# Altium schematic sheet MKRWANV1.0_0.SchDoc: MKRWANV1.0
size 409 x 291 mm; Origin: Eagle; Date: 4/10/2019 9:46:02 AM; SheetNumber: 1; CODE-ARDUINO: DNP; DATASHEET: DNP; DISTRIBUTOR-LINK: DNP; DISTRIBUTOR-PN: DNP; MANUFACTURER: DNP; MANUFACTURER-PN: DNP; NOTE: DNP; Value: DNP; GateName_1: G$1; SymbolName_1: A3L-LOC; LibraryName: Arduino-utility; DeviceSetName: A3-FRAME; Sheet: Sheet:; ReferenceDesignsAREPROVIDED"ASIS"AND"WITHALLFAULTS.ArduinoSADISCLAIMSALLOTHERWARRANTIES,EXPRESSORIMPLIED,
REGARDINGPRODUCTS,INCLUDINGBUTNOTLIMITEDTO,ANYIMPLIEDWARRANTIESOFMERCHANTABILITYORFITNESSFORAPARTICULARPURPOSE

ArduinoSAmaymakechangestospecificationsandproductdescriptionsatanytime,withoutnotice.TheCustomermustnot
relyontheabsenceorcharacteristicsofanyfeaturesorinstructionsmarked"reserved"or"undefined."ArduinoSAreserves
theseforfuturedefinitionandshallhavenoresponsibilitywhatsoeverforconflictsorincompatibilitiesarisingfromfuturechangestothem.
TheproductinformationontheWebSiteorMaterialsissubjecttochangewithoutnotice.Donotfinalizeadesignwiththisinfo

ARDUINOandotherArduinobrandsandlogosandTrademarksofArduinoSA.AllArduinoSATrademarkscannotbeusedwithoutowner'sformalpermission: Reference Designs ARE PROVIDED "AS IS" AND "WITH ALL FAULTS. Arduino SA DISCLAIMS ALL OTHER WARRANTIES, EXPRESS OR IMPLIED, / REGARDING PRODUCTS, INCLUDING BUT NOT LIMITED TO, ANY IMPLIED WARRANTIES OF MERCHANTABILITY OR FITNESS FOR A PARTICULAR PURPOSE / Arduino SA may make changes to specifications and product descriptions at any time, without notice. The Customer must not / rely on the absence or characteristics of any features or instructions marked "reserved" or "undefined." Arduino SA reserves / these for future definition and shall have no responsibility whatsoever for conflicts or incompatibilities arising from future changes to them. / The product information on the Web Site or Materials is subject to change without notice. Do not finalize a design with this info / ARDUINO and other Arduino brands and logos and Trademarks of Arduino SA. All Arduino SA Trademarks cannot be used without owner's formal permission
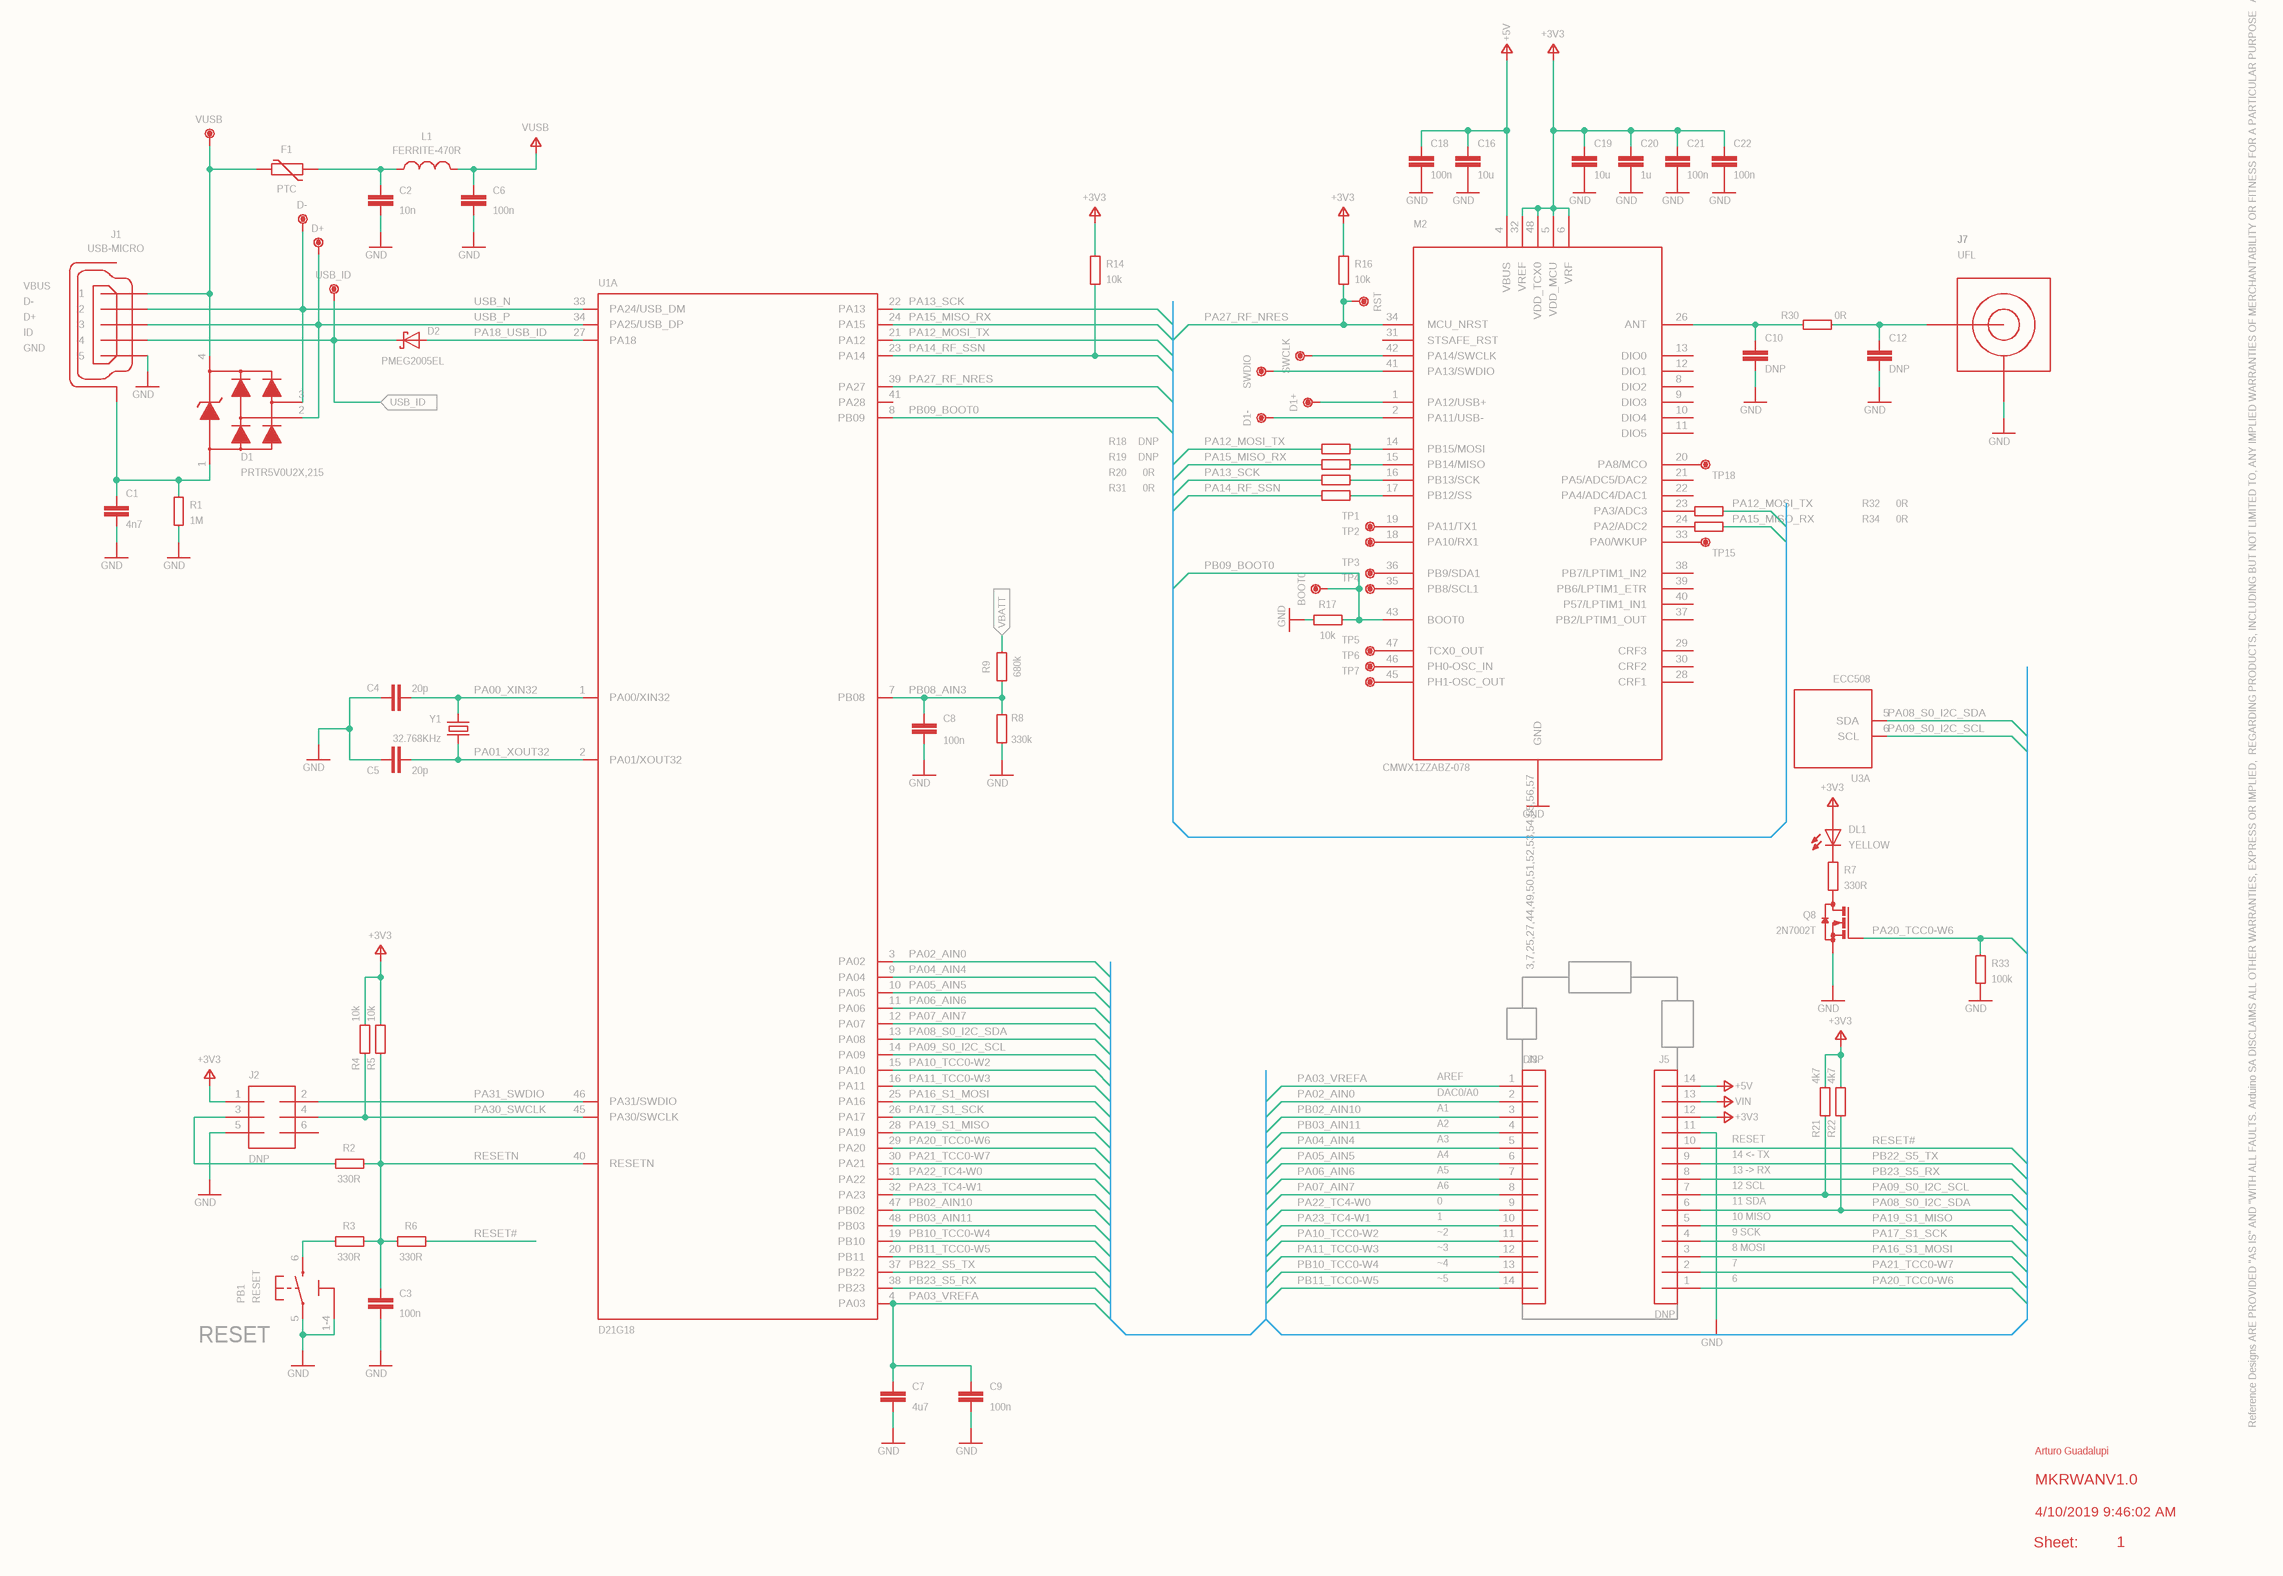
[diagram p0: MKRWANV1.0_0.SchDoc]

## Parts
+3V2  +3V3
+3V4  +3V3
+3V5  +3V3
+3V6  +3V3
+3V31  +3V3
+3V32  +3V3
+3V34  +3V3
+3V36  +3V3
BOOT0  DNP  [TP-1.00MM]  (value not drawn)
C1  4n7  [0805-R2013X50N]
C2  10n  [0402-1005X55N]
C3  100n  [0402-1005X55N]
C4  20p  [0402-1005X55N]
C5  20p  [0402-1005X55N]
C6  100n  [0402-1005X55N]
C7  4u7  [0402-1005X55N]
C8  100n  [0402-1005X55N]
C9  100n  [0402-1005X55N]
C10  DNP  [0402-1005X55N]
C12  DNP  [0402-1005X55N]
C16  10u  [0603-1608X90N]
C18  100n  [0402-1005X55N]
C19  10u  [0603-1608X90N]
C20  1u  [0402-1005X55N]
C21  100n  [0402-1005X55N]
C22  100n  [0402-1005X55N]
D1  PRTR5V0U2X,215  [SOT190P230X110-4N]
D1+  DNP  [TP-1.00MM]  (value not drawn)
D1-  DNP  [TP-1.00MM]  (value not drawn)
D2  PMEG2005EL  [SODFL1008X40N-882D]
D+  DNP  [TP-1.00MM]  (value not drawn)
D-  DNP  [TP-1.00MM]  (value not drawn)
DL1  YELLOW  [LEDC1608X80N-AK]
F1  PTC  [0603-1608X90N]
GND1  GND
GND2  GND
GND3  GND
GND4  GND
GND5  GND
GND6  GND
GND7  GND
GND8  GND
GND9  GND
GND10  GND
GND11  GND
GND12  GND
GND13  GND
GND15  GND
GND17  GND
GND19  GND
GND21  GND
GND22  GND
GND23  GND
GND24  GND
GND33  GND
GND34  GND
GND35  GND
GND36  GND
GND37  GND
GND38  GND
GND39  GND
J1  USB-MICRO  [ZX62-AB-5PA]
J2  DNP  [2X3_SMT]
J3  DNP  [1X14_SMD_TH]
J5  DNP  [1X14_SMD_TH]
J7  UFL  [U.FL-R-SMT-1(60)]
L1  FERRITE-470R  [0603-1608X90N@1]
M2  CMWX1ZZABZ-078  [CMWX1ZZABZ-078]
P+1  +5V
P+2  +5V
PB1  RESET  [C&K_PTS820_NO_HOLES]
Q8  2N7002T  [SOTFL50P160X78-3]
R1  1M  [0402-1005X55N]
R2  330R  [0402-1005X55N]
R3  330R  [0402-1005X55N]
R4  10k  [0402-1005X55N]
R5  10k  [0402-1005X55N]
R6  330R  [0402-1005X55N]
R7  330R  [0402-1005X55N]
R8  330k  [0402-1005X55N]
R9  680k  [0402-1005X55N]
R14  10k  [0402-1005X55N]
R16  10k  [0402-1005X55N]
R17  10k  [0402-1005X55N]
R18  DNP  [0402-1005X55N]
R19  DNP  [0402-1005X55N]
R20  0R  [0402-1005X55N]
R21  4k7  [0402-1005X55N]
R22  4k7  [0402-1005X55N]
R30  0R  [0402-1005X55N]
R31  0R  [0402-1005X55N]
R32  0R  [0402-1005X55N]
R33  100k  [0402-1005X55N]
R34  0R  [0402-1005X55N]
RST  DNP  [TP-1.00MM]  (value not drawn)
SWCLK  DNP  [TP-1.00MM]  (value not drawn)
SWDIO  DNP  [TP-1.00MM]  (value not drawn)
TP1  DNP  [TP-0.50MM]  (value not drawn)
TP2  DNP  [TP-0.50MM]  (value not drawn)
TP3  DNP  [TP-0.50MM]  (value not drawn)
TP4  DNP  [TP-0.50MM]  (value not drawn)
TP5  DNP  [TP-0.50MM]  (value not drawn)
TP6  DNP  [TP-0.50MM]  (value not drawn)
TP7  DNP  [TP-0.50MM]  (value not drawn)
TP15  DNP  [TP-0.50MM]  (value not drawn)
TP18  DNP  [TP-0.50MM]  (value not drawn)
U1  D21G18  [QFN50P700X700X90-49XN-EPSQ515]  (part A of 2)
U3  ECC508  [SON50P300X200X60-9N-EP160X140]  (part A of 2)
USB_ID  DNP  [TP-1.00MM]  (value not drawn)
V1  VUSB
VIN1  VIN
VUSB  DNP  [TP-1.00MM]  (value not drawn)
Y1  32.768KHz  [ABS07]

## Ports
USB_ID (in), VBATT (in)

## Nets
PA00_XIN32: C4.2 U1.1(PA00/XIN32) Y1.2
PA01_XOUT32: C5.2 U1.2(PA01/XOUT32) Y1.1
PA02_AIN0: J3.2 U1.3(PA02)
PA03_VREFA: C7.1 C9.1 J3.1 U1.4(PA03)
PA04_AIN4: J3.5 U1.9(PA04)
PA05_AIN5: J3.6 U1.10(PA05)
PA06_AIN6: J3.7 U1.11(PA06)
PA07_AIN7: J3.8 U1.12(PA07)
PA08_S0_I2C_SDA: J5.6 R22.1 U1.13(PA08) U3.5(SDA)
PA09_S0_I2C_SCL: J5.7 R21.1 U1.14(PA09) U3.6(SCL)
PA10_TCC0-W2: J3.11 U1.15(PA10)
PA11_TCC0-W3: J3.12 U1.16(PA11)
PA12_MOSI_TX: R18.2 R32.2 U1.21(PA12)
PA13_SCK: R20.2 U1.22(PA13)
PA14_RF_SSN: R14.1 R31.2 U1.23(PA14)
PA15_MISO_RX: M2.34(MCU_NRST) R16.1 R19.2 R34.2 RST.X(P$1) U1.24(PA15) U1.39(PA27)  [also labelled PA27_RF_NRES]
PA16_S1_MOSI: J5.3 U1.25(PA16)
PA17_S1_SCK: J5.4 U1.26(PA17)
PA18_USB_ID: D2.A U1.27(PA18)
PA19_S1_MISO: J5.5 U1.28(PA19)
PA20_TCC0-W6: J5.1 Q8.G R33.2 U1.29(PA20)
PA21_TCC0-W7: J5.2 U1.30(PA21)
PA22_TC4-W0: J3.9 U1.31(PA22)
PA23_TC4-W1: J3.10 U1.32(PA23)
PA30_SWCLK: J2.4 R4.1 U1.45(PA30/SWCLK)
PA31_SWDIO: J2.2 U1.46(PA31/SWDIO)
PB02_AIN10: J3.3 U1.47(PB02)
PB03_AIN11: J3.4 U1.48(PB03)
PB08_AIN3: C8.1 R8.2 R9.1 U1.7(PB08)
PB09_BOOT0: BOOT0.X(P$1) M2.43(BOOT0) R17.2 U1.8(PB09)
PB10_TCC0-W4: J3.13 U1.19(PB10)
PB11_TCC0-W5: J3.14 U1.20(PB11)
PB22_S5_TX: J5.9 U1.37(PB22)
PB23_S5_RX: J5.8 U1.38(PB23)
RESET#: J5.10 R6.2
RESETN: C3.1 R2.2 R3.2 R5.1 R6.1 U1.40(RESETN)
USB_ID: D2.C J1.4 USB_ID.X(P$1) ; port USB_ID
USB_N: D1.3 D-.X(P$1) J1.2 U1.33(PA24/USB_DM)
USB_P: D1.2 D+.X(P$1) J1.3 U1.34(PA25/USB_DP)
VBATT: R9.2 ; port VBATT
Net+3V2_?1: +3V2.?1(+3V3) DL1.A
Net+3V4_?1: +3V4.?1(+3V3) C19.1 C20.1 C21.1 C22.1 M2.5(VDD_MCU) M2.6(VRF) M2.32(VREF) M2.48(VDD_TCX0)
Net+3V5_?1: +3V5.?1(+3V3) R14.2
Net+3V6_?1: +3V6.?1(+3V3) R16.2
Net+3V31_?1: +3V31.?1(+3V3) J2.1
Net+3V32_?1: +3V32.?1(+3V3) R4.2 R5.2
Net+3V34_?1: +3V34.?1(+3V3) J5.12
Net+3V36_?1: +3V36.?1(+3V3) R21.2 R22.2
NetC1_1: C1.1 D1.1 J1.6-11(SH) R1.2
NetC1_2: C1.2 GND1.?1(GND)
NetC2_1: C2.1 F1.1 L1.1
NetC2_2: C2.2 GND7.?1(GND)
NetC3_2: C3.2 GND8.?1(GND)
NetC4_1: C4.1 C5.1 GND6.?1(GND)
NetC6_1: C6.1 L1.2 V1.?1(VUSB)
NetC6_2: C6.2 GND9.?1(GND)
NetC7_2: C7.2 GND10.?1(GND)
NetC8_2: C8.2 GND11.?1(GND)
NetC9_2: C9.2 GND12.?1(GND)
NetC10_1: C10.1 M2.26(ANT) R30.1
NetC10_2: C10.2 GND24.?1(GND)
NetC12_1: C12.1 J7.SIG R30.2
NetC12_2: C12.2 GND23.?1(GND)
NetC16_1: C16.1 C18.1 M2.4(VBUS) P+1.?1(+5V)
NetC16_2: C16.2 GND35.?1(GND)
NetC18_2: C18.2 GND36.?1(GND)
NetC19_2: C19.2 GND37.?1(GND)
NetC20_2: C20.2 GND38.?1(GND)
NetC21_2: C21.2 GND39.?1(GND)
NetC22_2: C22.2 GND21.?1(GND)
NetD1+_X: D1+.X(P$1) M2.1(PA12/USB+)
NetD1-_X: D1-.X(P$1) M2.2(PA11/USB-)
NetD1_4: D1.4 F1.2 J1.1 VUSB.X(P$1)
NetDL1_C: DL1.C R7.2
NetGND2_?1: GND2.?1(GND) J1.5
NetGND3_?1: GND3.?1(GND) R1.1
NetGND4_?1: GND4.?1(GND) J2.5
NetGND5_?1: GND5.?1(GND) PB1.1-4 PB1.5
NetGND13_?1: GND13.?1(GND) R8.1
NetGND15_?1: GND15.?1(GND) Q8.S
NetGND17_?1: GND17.?1(GND) M2.3,7,25,27,44,49,50,51,52,53,54,55,56,57(GND)
NetGND19_?1: GND19.?1(GND) J5.11
NetGND22_?1: GND22.?1(GND) J7.GND1,2(GND)
NetGND33_?1: GND33.?1(GND) R33.1
NetGND34_?1: GND34.?1(GND) R17.1
NetJ2_3: J2.3 R2.1
NetJ5_13: J5.13 VIN1.?1(VIN)
NetJ5_14: J5.14 P+2.?1(+5V)
NetM2_14: M2.14(PB15/MOSI) R18.1
NetM2_15: M2.15(PB14/MISO) R19.1
NetM2_16: M2.16(PB13/SCK) R20.1
NetM2_17: M2.17(PB12/SS) R31.1
NetM2_18: M2.18(PA10/RX1) TP2.X(P$1)
NetM2_19: M2.19(PA11/TX1) TP1.X(P$1)
NetM2_20: M2.20(PA8/MCO) TP18.X(P$1)
NetM2_23: M2.23(PA3/ADC3) R32.1
NetM2_24: M2.24(PA2/ADC2) R34.1
NetM2_33: M2.33(PA0/WKUP) TP15.X(P$1)
NetM2_35: M2.35(PB8/SCL1) TP4.X(P$1)
NetM2_36: M2.36(PB9/SDA1) TP3.X(P$1)
NetM2_41: M2.41(PA13/SWDIO) SWDIO.X(P$1)
NetM2_42: M2.42(PA14/SWCLK) SWCLK.X(P$1)
NetM2_45: M2.45(PH1-OSC_OUT) TP7.X(P$1)
NetM2_46: M2.46(PH0-OSC_IN) TP6.X(P$1)
NetM2_47: M2.47(TCX0_OUT) TP5.X(P$1)
NetPB1_6: PB1.6 R3.1
NetQ8_D: Q8.D R7.1

Not connected (* = marked no-connect by the designer): J2 6; M2 8(DIO2) 9(DIO3) 10(DIO4) 11(DIO5) 12(DIO1) 13(DIO0) 21(PA5/ADC5/DAC2) 22(PA4/ADC4/DAC1) 28(CRF1) 29(CRF3) 30(CRF2) 31(STSAFE_RST) 37(PB2/LPTIM1_OUT) 38(PB7/LPTIM1_IN2) 39(PB6/LPTIM1_ETR) 40(P57/LPTIM1_IN1); U1 41(PA28)

## Notes on the sheet
- AREF
- (near J3) DAC0/A0
- A1
- A2
- A3
- A4
- A5
- A6
- 14 <- TX
- 13 -> RX
- 12 SCL
- (near +3V34) RESET
- 0
- 1
- ~2
- ~3
- ~4
- 11 SDA
- 7
- 8 MOSI
- 9 SCK
- 10 MISO
- RESET
- ~5
- 6
- Reference Designs ARE PROVIDED "AS IS" AND "WITH ALL FAULTS. Arduino SA DISCLAIMS ALL OTHER WARRANTIES, EXPRESS OR IMPLIED,
  REGARDING PRODUCTS, INCLUDING BUT NOT LIMITED TO, ANY IMPLIED WARRANTIES OF MERCHANTABILITY OR FITNESS FOR A PARTICULAR PURPOSE
  Arduino SA may make changes to specifications and product descriptions at any time, without notice. The Customer must not
  rely on the absence or characteristics of any features or instructions marked "reserved" or "undefined." Arduino SA reserves
  these for future definition and shall have no responsibility whatsoever for conflicts or incompatibilities arising from future changes to them.
  The product information on the Web Site or Materials is subject to change without notice. Do not finalize a design with this info
  ARDUINO and other Arduino brands and logos and Trademarks of Arduino SA. All Arduino SA Trademarks cannot be used without owner's formal permission
- Arturo Guadalupi
- MKRWANV1.0
- Sheet:
- 4/10/2019 9:46:02 AM

## Library data of the parts
+3V2 +3V4-+3V6 +3V31 +3V32 +3V34 +3V36 = +3V3: SUPPLY SYMBOL; GateName_1: G$1; SymbolName_1: +3V3; LibraryName: MK1_Zero; DeviceSetName: +3V3
BOOT0 D1+ D1- D+ D- RST SWCLK SWDIO USB_ID VUSB = TPTP-1.00MM: Testpoint; GateName_1: G$1; DeviceSetName: TP; SymbolName_1: TESTPOINT; DeviceName: TP-1.00MM; LibraryName: Arduino-utility; DATASHEET: DNP; DISTRIBUTOR-LINK: DNP; DISTRIBUTOR-PN: DNP; MANUFACTURER: DNP; MANUFACTURER-PN: DNP
C1 = C-0805: SMD Capacitor; MANUFACTURER: Kemet; MANUFACTURER-PN: C0805C472KDRACTU; GateName_1: G$1; SymbolName_1: C; DeviceName: -0805; LibraryName: Arduino-rcl; DeviceSetName: C; DATASHEET: http://www.kemet.com/Lists/ProductCatalog/Attachments/40/KEM_C1010_X7R_HV_SMD.pdf; DISTRIBUTOR-LINK: www.kemet.com/docfinder?Partnumber=C0805C472KDRACTU; DISTRIBUTOR-PN: 399-6738-1-ND
C2 = C-0402: SMD Capacitor; MANUFACTURER: Murata; MANUFACTURER-PN: GRM155R71H103KA88J; GateName_1: G$1; SymbolName_1: C; DeviceName: -0402; LibraryName: Arduino-rcl; DeviceSetName: C; DATASHEET: http://search.murata.co.jp/Ceramy/image/img/A01X/partnumbering_e_01.pdf; DISTRIBUTOR-LINK: http://www.digikey.com/product-detail/en/murata-electronics-north-america/GRM155R71H103KA88J/490-6351-1-ND/3845548; DISTRIBUTOR-PN: 490-6351-1-ND
C3 C6 C8 C9 C18 C21 C22 = C-0402: SMD Capacitor; MANUFACTURER: TDK; MANUFACTURER-PN: C1005X5R1H104K050BB; GateName_1: G$1; SymbolName_1: C; DeviceName: -0402; LibraryName: Arduino-rcl; DeviceSetName: C; DATASHEET: http://www.tdk.com/pdf/TDKMLCCCapRange.pdf; DISTRIBUTOR-LINK: http://www.digikey.com/product-detail/en/tdk-corporation/C1005X5R1H104K050BB/445-5942-1-ND/2443982; DISTRIBUTOR-PN: 445-5942-1-ND
C4 C5 = C-0402: SMD Capacitor; MANUFACTURER: Kemet; MANUFACTURER-PN: CBR04C200J5GAC; GateName_1: G$1; SymbolName_1: C; DeviceName: -0402; LibraryName: Arduino-rcl; DeviceSetName: C; DATASHEET: http://www.kemet.com/docfinder?Partnumber=CBR04C200J5GAC; DISTRIBUTOR-LINK: http://www.digikey.com/product-detail/en/kemet/CBR04C200J5GAC/399-6173-1-ND/2732143; DISTRIBUTOR-PN: 399-6173-1-ND
C7 = C-0402: SMD Capacitor; MANUFACTURER: Murata; MANUFACTURER-PN: GRM155R60J475ME47D; GateName_1: G$1; SymbolName_1: C; DeviceName: -0402; LibraryName: Arduino-rcl; DeviceSetName: C; DATASHEET: http://search.murata.co.jp/Ceramy/image/img/A01X/partnumbering_e_01.pdf; DISTRIBUTOR-LINK: http://www.digikey.com/product-detail/en/murata-electronics-north-america/GRM155R60J475ME47D/490-5915-1-ND/3719860; DISTRIBUTOR-PN: 490-5915-1-ND
C10 C12 = C-0402: SMD Capacitor; GateName_1: G$1; SymbolName_1: C; DeviceName: -0402; LibraryName: Arduino-rcl; DeviceSetName: C; DATASHEET: DNP; DISTRIBUTOR-LINK: DNP; DISTRIBUTOR-PN: DNP; MANUFACTURER: DNP; MANUFACTURER-PN: DNP
C16 C19 = C-0603: SMD Capacitor; MANUFACTURER: Murata; MANUFACTURER-PN: GRM188R61C106KAALD; GateName_1: G$1; SymbolName_1: C; DeviceName: -0603; LibraryName: Arduino-rcl; DeviceSetName: C; DATASHEET: http://www.murata.com/~/media/webrenewal/support/library/catalog/products/capacitor/mlcc/c02e.pdf; DISTRIBUTOR-LINK: http://www.digikey.com/product-search/en?keywords=490-10728-1-ND; DISTRIBUTOR-PN: 490-10728-1-ND
C20 = C-0402: SMD Capacitor; MANUFACTURER: Murata; MANUFACTURER-PN: GRM155R61E105KA12D; GateName_1: G$1; SymbolName_1: C; DeviceName: -0402; LibraryName: Arduino-rcl; DeviceSetName: C; DATASHEET: http://search.murata.co.jp/Ceramy/image/img/A01X/partnumbering_e_01.pdf; DISTRIBUTOR-LINK: http://www.digikey.com/product-detail/en/murata-electronics-north-america/GRM155R61E105KA12D/490-10017-1-ND/5026367; DISTRIBUTOR-PN: 490-10017-1-ND
D1 = PRTR5V0U2X,215: USB ESD protection; MANUFACTURER: NXP; GateName_1: G$1; SymbolName_1: PRTR5V0U2X; LibraryName: Arduino-diodes; DeviceSetName: PRTR5V0U2X,215; DATASHEET: http://www.nxp.com/documents/data_sheet/PRTR5V0U2X.pdf; DISTRIBUTOR-LINK: http://www.digikey.com/product-detail/en/nxp-semiconductors/PRTR5V0U2X,215/568-4140-1-ND/1589981; DISTRIBUTOR-PN: 568-4140-1-ND; MANUFACTURER-PN: PRTR5V0U2X,215
D2 = PMEG2005EL: DIODE SCHOTTKY 20V 500MA SOD882; MANUFACTURER: NXP; MANUFACTURER-PN: PMEG2005EL,315; GateName_1: G$1; SymbolName_1: SCHOTTKY-1; LibraryName: Arduino-diodes; DeviceSetName: PMEG2005EL; DATASHEET: http://www.nxp.com/documents/data_sheet/PMEG2005EL.pdf; DISTRIBUTOR-LINK: http://www.digikey.com/product-detail/en/nxp-semiconductors/PMEG2005EL,315/568-6754-1-ND/2676794; DISTRIBUTOR-PN: 568-6754-1-ND
DL1 = LED-0603: LED; MANUFACTURER: Avago; MANUFACTURER-PN: HSMY-C190; GateName_1: G$1; DeviceName: -0603; SymbolName_1: LED; LibraryName: Arduino-diodes; DeviceSetName: LED; DATASHEET: http://media.digikey.com/pdf/Data%20Sheets/Avago%20PDFs/HSMz-Czzz.pdf; DISTRIBUTOR-LINK: http://www.digikey.com/product-detail/en/broadcom-limited/HSMY-C190/516-1424-1-ND/637748; DISTRIBUTOR-PN: 516-1424-1-ND
F1 = PTC: SMD PTC; MANUFACTURER: Bourns Inc; MANUFACTURER-PN: MF-FSMF050X-2; GateName_1: G$1; SymbolName_1: PTC; LibraryName: Arduino-rcl; DeviceSetName: PTC; DATASHEET: http://www.bourns.com/docs/Product-Datasheets/mffsmf.pdf; DISTRIBUTOR-LINK: http://www.digikey.com/product-detail/en/bourns-inc/MF-FSMF050X-2/MF-FSMF050X-2CT-ND/2039389; DISTRIBUTOR-PN: MF-FSMF050X-2CT-ND
GND1-GND13 GND15 GND17 GND19 GND21-GND24 GND33-GND39 = GND: SUPPLY SYMBOL; GateName_1: 1; SymbolName_1: GND; LibraryName: supply1; DeviceSetName: GND
J1 = USB-MICRO: USB - micro AB USB 2.0 Receptacle Connector 5 Position Surface Mount, Right Angle, Horizontal; MANUFACTURER: Hirose; MANUFACTURER-PN: ZX62-AB-5PA(31); GateName_1: G$1; SymbolName_1: USB-MICRO; LibraryName: Arduino-connectors; DeviceSetName: USB-MICRO; VBUS: VBUS; D-: D-; D+: D+; ID: ID; GND: GND; DATASHEET: https://www.hirose.com/product/en/download_file/key_name/ZX/category/Catalog/doc_file_id/31704/?file_category_id=4&item_id=13&is_series=1; DISTRIBUTOR-LINK: http://www.digikey.com/product-detail/en/hirose-electric-co-ltd/ZX62-AB-5PA(31)/H125279CT-ND/5994741; DISTRIBUTOR-PN: H125279CT-ND
J2 = 2X3_SMD_MALE: SMD connector; GateName_1: G$1; SymbolName_1: 3X02; LibraryName: Arduino-connectors; DeviceSetName: 2X3_SMD_MALE; DATASHEET: DNP; DISTRIBUTOR-LINK: DNP; DISTRIBUTOR-PN: DNP; MANUFACTURER: DNP; MANUFACTURER-PN: DNP
J3 J5 = PINHD-1X14-SMTH-SMD: PIN HEADER; MANUFACTURER: ELDECO; MANUFACTURER-PN: FH254114DF08500T; GateName_1: G$1; SymbolName_1: PINH-1X14-SM; DeviceName: TH-SMD; LibraryName: Arduino-connectors; DeviceSetName: PINHD-1X14-SM; DATASHEET: -; DISTRIBUTOR-LINK: -; DISTRIBUTOR-PN: -
J7 = UFL: U.FL, Ultra Miniature Coaxial Connector Receptacle, Male Pin 50 Ohm Surface Mount Solder; MANUFACTURER: Hirose; GateName_1: G$1; SymbolName_1: U.FL-R-SMT-1(60); LibraryName: Arduino-connectors; DeviceSetName: UFL; DATASHEET: http://media.digikey.com/pdf/Data%20Sheets/Hirose%20PDFs/UFL%20Series.pdf; DISTRIBUTOR-LINK: http://www.digikey.com/product-search/en?keywords=U.FL-R-SMT-1(60); DISTRIBUTOR-PN: U.FL-R-SMT-1(60)-ND; MANUFACTURER-PN: U.FL-R-SMT-1(60)
L1 = FERRITE-470R: FERRITE BEAD 470 OHM 0603 1LN; MANUFACTURER: Murata; MANUFACTURER-PN: BLM18PG471SN1D; GateName_1: G$1; SymbolName_1: L; LibraryName: Arduino-rcl; DeviceSetName: FERRITE-470R; DATASHEET: http://search.murata.co.jp/Ceramy/image/img/PDF/ENG/L0110S0100BLM18P.pdf; DISTRIBUTOR-LINK: http://www.digikey.com/product-detail/en/murata-electronics-north-america/BLM18PG471SN1D/490-5223-1-ND/1948399; DISTRIBUTOR-PN: 490-5223-1-ND
M2 = CMWX1ZZABZ-078: MANUFACTURER: Murata; GateName_1: G$1; SymbolName_1: CMWX1ZZABZ-078; LibraryName: Arduino-ucs&SoCs; DeviceSetName: CMWX1ZZABZ-078; CMWX1ZZABZ-078: CMWX1ZZABZ-078; DATASHEET: https://www.arrow.altech.co.za/sites/arrow/files/Murata%20LoRa%20Module%20Preliminary%20Datasheet%20SP-ABZ-G.PDF; DISTRIBUTOR-LINK: https://www.digikey.com/product-detail/en/murata-electronics-north-america/CMWX1ZZABZ-078/490-16143-1-ND/6834151; DISTRIBUTOR-PN: 490-16143-1-ND; MANUFACTURER-PN: CMWX1ZZABZ-078
P+1 P+2 = +5V: SUPPLY SYMBOL; GateName_1: 1; SymbolName_1: +5V; LibraryName: MK1_Zero; DeviceSetName: +5V
PB1 = TACTILE1: Tactile Switch SPST-NO Top Actuated Surface Mount; MANUFACTURER: C&K; MANUFACTURER-PN: PTS820 J25K SMTR LFS; GateName_1: G$1; SymbolName_1: TACTILE-3PINS; LibraryName: Arduino-pushbuttons; DeviceSetName: TACTILE1; DATASHEET: http://www.ckswitches.com/media/1474/pts820.pdf; DISTRIBUTOR-LINK: http://www.digikey.com/product-detail/en/c-k-components/PTS820%20J25K%20SMTR%20LFS/PTS820%20J25K%20SMTR%20LFS-ND/4142165; DISTRIBUTOR-PN: PTS820 J25K SMTR LFS-ND
Q8 = 2N7002T: MOSFET N-CH 60V 115MA SOT-523; MANUFACTURER: Diodes Incorporated; MANUFACTURER-PN: 2N7002T-7-F; GateName_1: G$1; SymbolName_1: N-MOS-1; LibraryName: Arduino-transistors; DeviceSetName: 2N7002T; DATASHEET: http://www.diodes.com/_files/datasheets/ds30301.pdf; DISTRIBUTOR-LINK: http://www.digikey.com/product-detail/en/diodes-incorporated/2N7002T-7-F/2N7002T-FDICT-ND/815290; DISTRIBUTOR-PN: 2N7002T-FDICT-ND
R1 = R-0402: SMD Resistor; MANUFACTURER: Yageo; MANUFACTURER-PN: RC0402JR-07330RL; GateName_1: G$1; SymbolName_1: R; DeviceName: -0402; LibraryName: Arduino-rcl; DeviceSetName: R; DATASHEET: www.yageo.com.tw/exep/pages/download/literatures/PYu-R_INT-thick_7.pdf; DISTRIBUTOR-LINK: http://www.digikey.com/product-detail/en/yageo/RC0402JR-07330RL/311-330JRCT-ND/729412; DISTRIBUTOR-PN: 311-330JRCT-ND
R2 R3 R6 R7 = R-0402: SMD Resistor; MANUFACTURER: Yageo; MANUFACTURER-PN: RC0402FR-07330RL; GateName_1: G$1; SymbolName_1: R; DeviceName: -0402; LibraryName: Arduino-rcl; DeviceSetName: R; DATASHEET: www.yageo.com.tw/exep/pages/download/literatures/PYu-R_INT-thick_7.pdf; DISTRIBUTOR-LINK: http://www.digikey.com/product-detail/en/yageo/RC0402FR-07330RL/311-330LRCT-ND/729541; DISTRIBUTOR-PN: 311-330LRCT-ND
R4 R5 R14 R16 R17 = R-0402: SMD Resistor; MANUFACTURER: Yageo; MANUFACTURER-PN: RC0402FR-0710KL; GateName_1: G$1; SymbolName_1: R; DeviceName: -0402; LibraryName: Arduino-rcl; DeviceSetName: R; DATASHEET: www.yageo.com.tw/exep/pages/download/literatures/PYu-R_INT-thick_7.pdf; DISTRIBUTOR-LINK: http://www.digikey.com/product-detail/en/yageo/RC0402FR-0710KL/311-10.0KLRCT-ND/729470; DISTRIBUTOR-PN: 311-10.0KLRCT-ND
R8 = R-0402: SMD Resistor; MANUFACTURER: Yageo; MANUFACTURER-PN: RC0402JR-07330KL; GateName_1: G$1; SymbolName_1: R; DeviceName: -0402; LibraryName: Arduino-rcl; DeviceSetName: R; DATASHEET: www.yageo.com.tw/exep/pages/download/literatures/PYu-R_INT-thick_7.pdf; DISTRIBUTOR-LINK: http://www.digikey.com/product-detail/en/yageo/RC0402JR-07330KL/311-330KJRCT-ND/729413; DISTRIBUTOR-PN: 311-330KJRCT-ND
R9 = R-0402: SMD Resistor; MANUFACTURER: Yageo; MANUFACTURER-PN: RC0402JR-07680KL; GateName_1: G$1; SymbolName_1: R; DeviceName: -0402; LibraryName: Arduino-rcl; DeviceSetName: R; DATASHEET: www.yageo.com.tw/exep/pages/download/literatures/PYu-R_INT-thick_7.pdf; DISTRIBUTOR-LINK: http://www.digikey.it/product-detail/it/yageo/RC0402JR-07680KL/311-680KJRTR-ND/726501; DISTRIBUTOR-PN: 311-680KJRTR-ND
R18 R19 = R-0402: SMD Resistor; GateName_1: G$1; SymbolName_1: R; DeviceName: -0402; LibraryName: Arduino-rcl; DeviceSetName: R; DATASHEET: DNP; DISTRIBUTOR-LINK: DNP; DISTRIBUTOR-PN: DNP; MANUFACTURER: DNP; MANUFACTURER-PN: DNP
R20 R30-R32 R34 = R-0402: SMD Resistor; MANUFACTURER: Yageo; MANUFACTURER-PN: RC0402FR-070RL; GateName_1: G$1; SymbolName_1: R; DeviceName: -0402; LibraryName: Arduino-rcl; DeviceSetName: R; DATASHEET: www.yageo.com.tw/exep/pages/download/literatures/PYu-R_INT-thick_7.pdf; DISTRIBUTOR-LINK: http://www.digikey.com/product-detail/en/yageo/RC0402FR-070RL/311-0.0LRCT-ND/2827888; DISTRIBUTOR-PN: 311-0.0LRCT-ND
R21 R22 = R-0402: SMD Resistor; MANUFACTURER: Yageo; MANUFACTURER-PN: RC0402FR-074K7L; GateName_1: G$1; SymbolName_1: R; DeviceName: -0402; LibraryName: Arduino-rcl; DeviceSetName: R; DATASHEET: www.yageo.com.tw/exep/pages/download/literatures/PYu-R_INT-thick_7.pdf; DISTRIBUTOR-LINK: http://www.digikey.com/product-detail/en/yageo/RC0402FR-074K7L/311-4.7KLRCT-ND/2827881; DISTRIBUTOR-PN: 311-4.7KLRCT-ND
R33 = R-0402: SMD Resistor; MANUFACTURER: Yageo; MANUFACTURER-PN: RC0402FR-07100KL; GateName_1: G$1; SymbolName_1: R; DeviceName: -0402; LibraryName: Arduino-rcl; DeviceSetName: R; DATASHEET: www.yageo.com.tw/exep/pages/download/literatures/PYu-R_INT-thick_7.pdf; DISTRIBUTOR-LINK: http://www.digikey.com/product-detail/en/yageo/RC0402FR-07100KL/311-100KLRCT-ND/729473; DISTRIBUTOR-PN: 311-100KLRCT-ND
TP1-TP7 TP15 TP18 = TPTP-0.5MM: Testpoint; GateName_1: G$1; DeviceSetName: TP; SymbolName_1: TESTPOINT; DeviceName: TP-0.5MM; LibraryName: Arduino-utility; DATASHEET: DNP; DISTRIBUTOR-LINK: DNP; DISTRIBUTOR-PN: DNP; MANUFACTURER: DNP; MANUFACTURER-PN: DNP
U1 = ATSAMD21G18A-48QFN: ARMÂ® CortexÂ®-M0+ SAM D21G Microcontroller IC 32-Bit 48MHz 256KB (256K x 8) FLASH 48-TQFP (7x7); MANUFACTURER: DNP; GateName_1: A; SymbolName_1: ATSAMD21G18A-48-A; GateName_2: B; SymbolName_2: ATSAMD21G18A-48-B; DeviceName: QFN; LibraryName: Arduino-ucs&SoCs; DeviceSetName: ATSAMD21G18A-48; DATASHEET: DNP; DISTRIBUTOR-LINK: DNP; DISTRIBUTOR-PN: DNP; MANUFACTURER-PN: DNP
U3 = ATECC508A-MAHDA-T8-UDFN: Secure authentication and product validation device, EEPROM, I2C, 2.0 - 5.5V; MANUFACTURER: Atmel; GateName_1: A; SymbolName_1: ATECC508A-A; GateName_2: B; SymbolName_2: ATECC508A-B; DeviceName: 8-UDFN; LibraryName: Arduino-ICs; DeviceSetName: ATECC508A-MAHDA-T; DATASHEET: http://www.atmel.com/Images/Atmel-8923S-CryptoAuth-ATECC508A-Datasheet-Summary.pdf; DISTRIBUTOR-LINK: http://www.digikey.com/product-detail/en/atmel/ATECC508A-MAHDA-T/ATECC508A-MAHDA-TCT-ND/5213071; DISTRIBUTOR-PN: ATECC508A-MAHDA-TCT-ND; MANUFACTURER-PN: ATECC508A-MAHDA-T
V1 = VUSB: GateName_1: G$1; SymbolName_1: VUSB; LibraryName: Supply; DeviceSetName: VUSB
VIN1 = VIN: GateName_1: G$1; SymbolName_1: VIN; LibraryName: Supply; DeviceSetName: VIN
Y1 = 32.768KHZ: LF crystal; MANUFACTURER: Abracon LLC; MANUFACTURER-PN: ABS07-32.768KHZ-T; GateName_1: G$1; SymbolName_1: Q; LibraryName: Arduino-crystals; DeviceSetName: 32.768KHZ; 1: 1; 2: 2; DATASHEET: http://www.abracon.com/Resonators/ABS07.pdf; DISTRIBUTOR-LINK: http://www.digikey.com/product-detail/en/abracon-llc/ABS07-32.768KHZ-T/535-9542-1-ND/1237009; DISTRIBUTOR-PN: 535-9542-1-ND